# Altium project Function Generator.PrjPcb
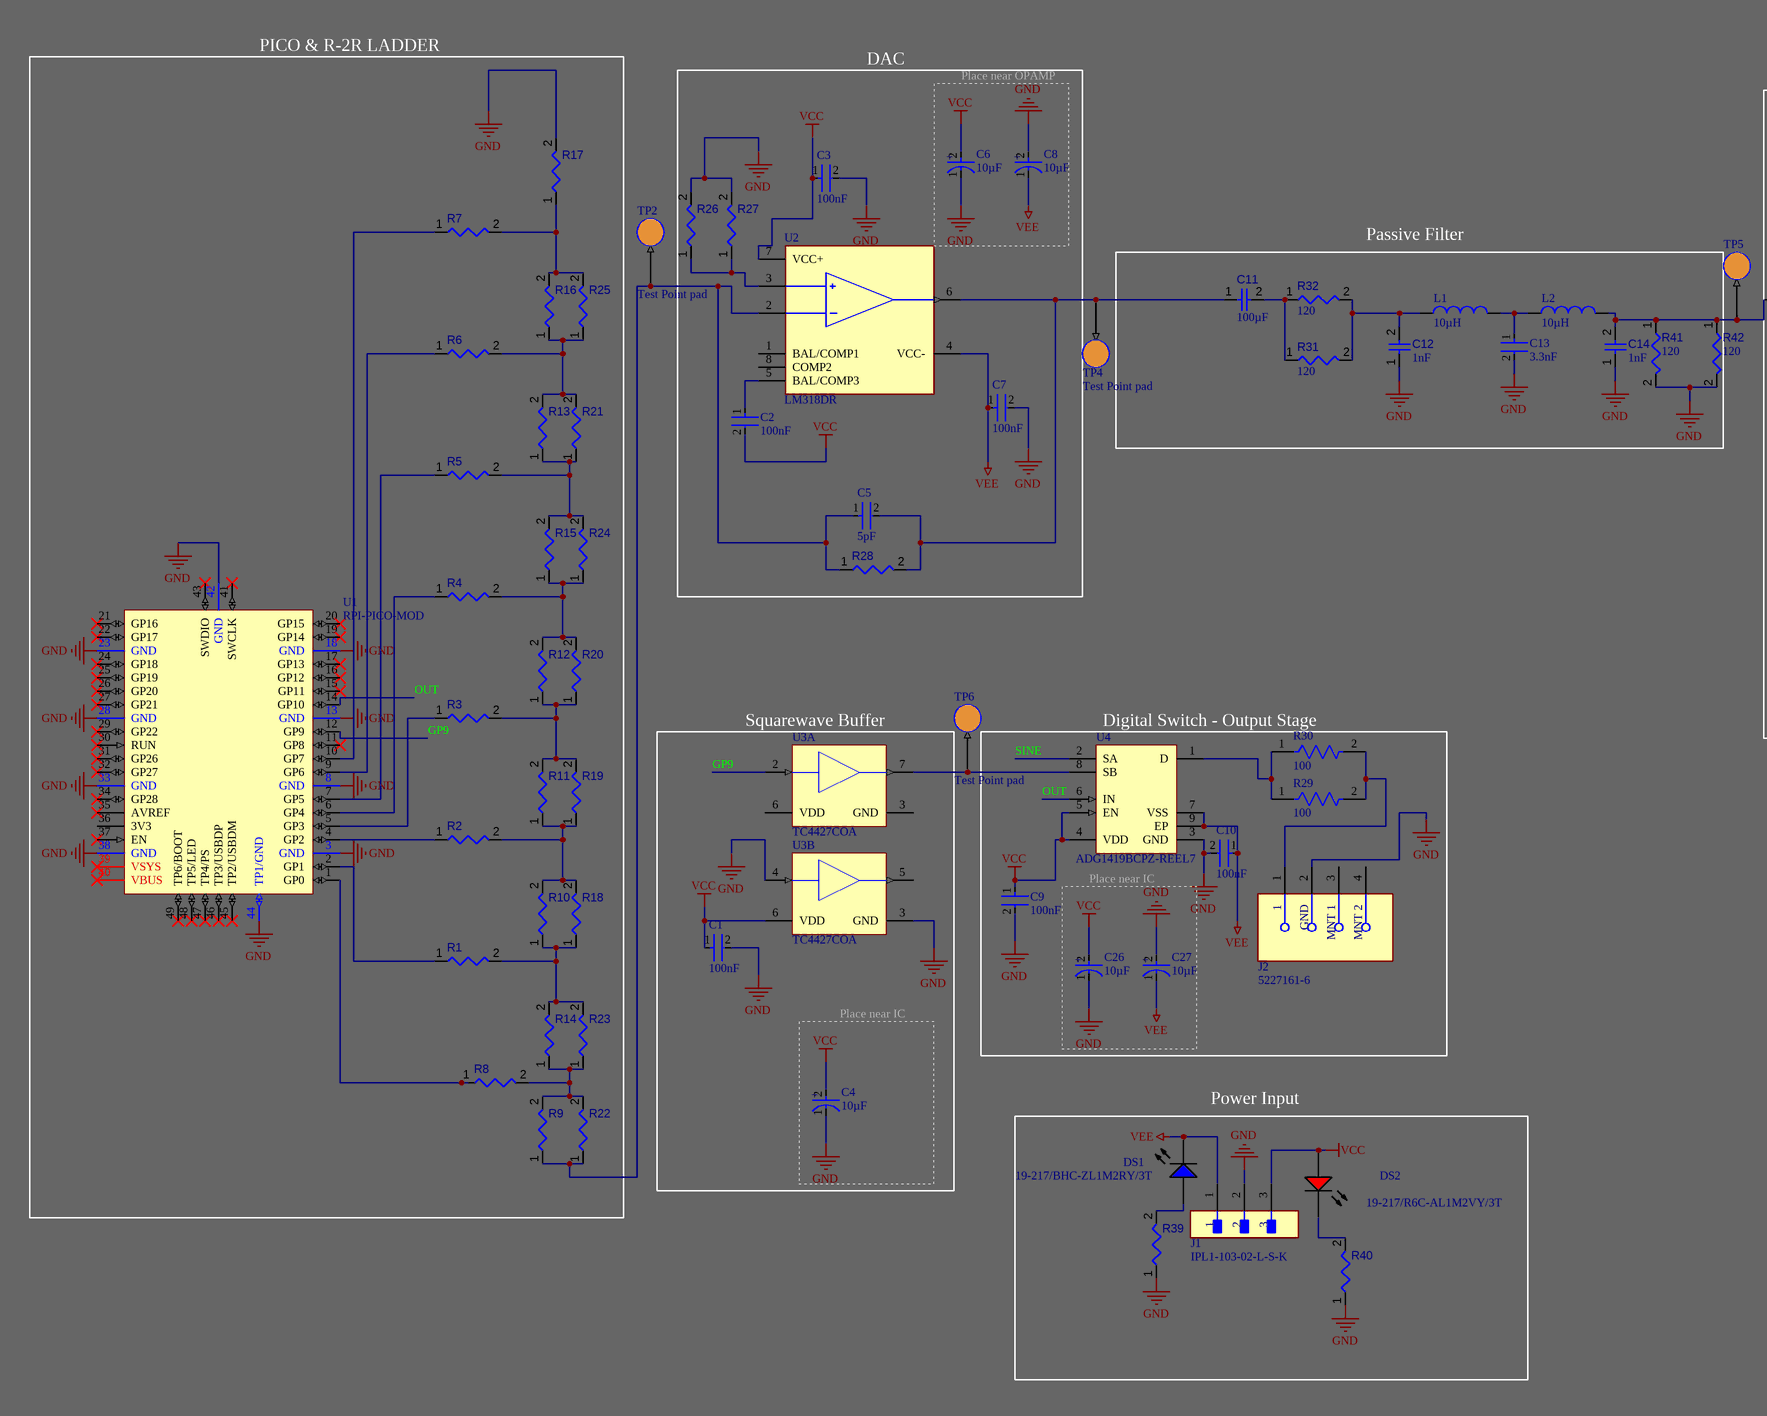
[diagram p0: Function-Generator.SchDoc, left]
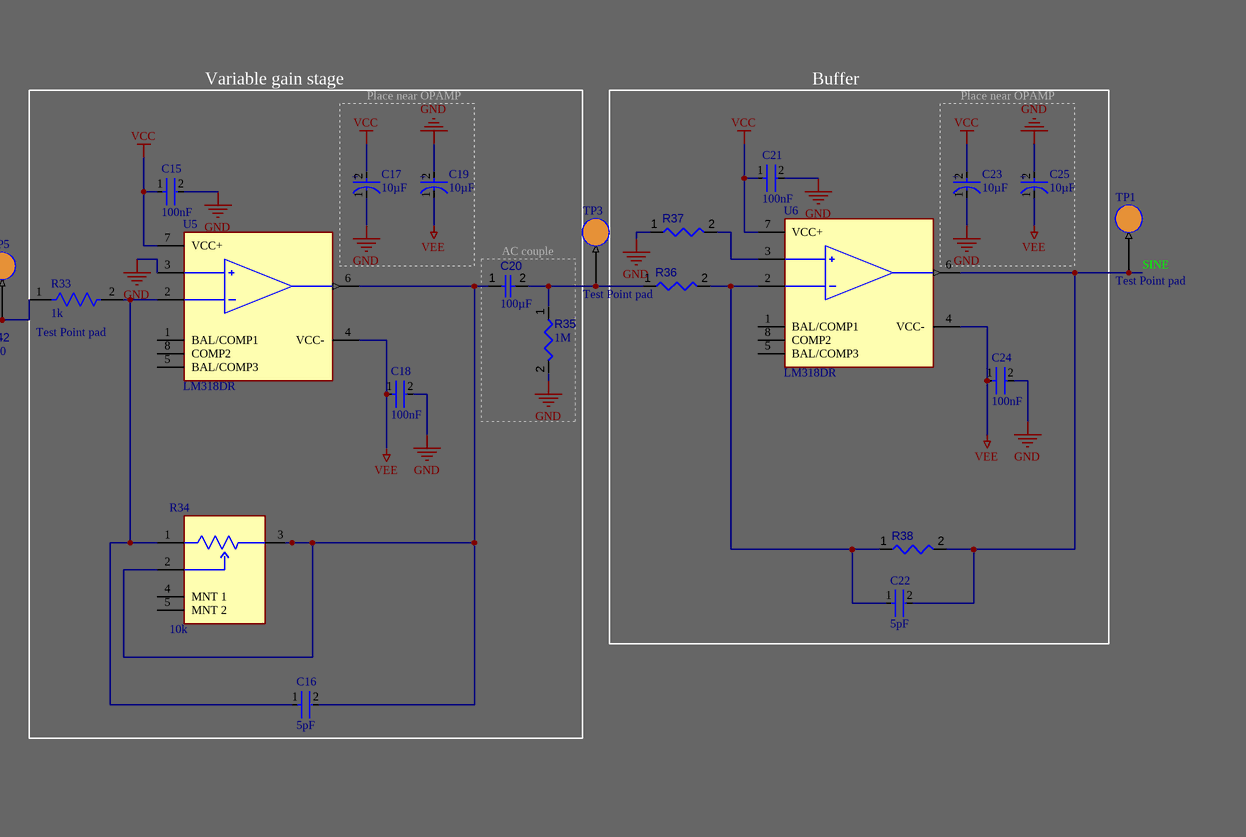
[diagram p1: Function-Generator.SchDoc, right]
1 sheet, 87 parts. Net scope: global (net labels, ports and power ports of the same name join across sheets).
Board file: Function-Generator.PcbDoc

## Sheet Function-Generator.SchDoc: Function Generator
size A2; Author: Lambros Savva; DrawnBy: Lambros Savva; DocumentNumber: 1; Revision: V1.0; SheetNumber: 1; SheetTotal: 1

### Parts
C1  value 100nF  [FP-CC0805-0_85-IPC_A]  (hidden comment: CL21B104KCFNNNE)
C2  value 100nF  [FP-CC0805-0_85-IPC_A]  (hidden comment: CL21B104KCFNNNE)
C3  value 100nF  [FP-CC0805-0_85-IPC_A]  (hidden comment: CL21B104KCFNNNE)
C4  value 10µF  [FP-FTB-MFG]  (hidden comment: EEEFTH100UAR)
C5  value 5pF  [FP-GCH188-0_1-e0_2_0_5-IPC_A]  (hidden comment: GCH1885C2A5R0CE01J)
C6  value 10µF  [FP-FTB-MFG]  (hidden comment: EEEFTH100UAR)
C7  value 100nF  [FP-CC0805-0_85-IPC_A]  (hidden comment: CL21B104KCFNNNE)
C8  value 10µF  [FP-FTB-MFG]  (hidden comment: EEEFTH100UAR)
C9  value 100nF  [FP-CC0805-0_85-IPC_A]  (hidden comment: CL21B104KCFNNNE)
C10  value 100nF  [FP-CC0805-0_85-IPC_A]  (hidden comment: CL21B104KCFNNNE)
C11  value 100µF  [CAPAE660650X800N]  (hidden comment: 25SEV100M6.3X8)
C12  value 1nF  [Chip2PinSM127P600-8N]  (hidden comment: 08055A102FAT2A)
C13  value 3.3nF  [FP-CL10-IPC_B]  (hidden comment: GCM1885C1H332FA16D)
C14  value 1nF  [Chip2PinSM127P600-8N]  (hidden comment: 08055A102FAT2A)
C15  value 100nF  [FP-CC0805-0_85-IPC_A]  (hidden comment: CL21B104KCFNNNE)
C16  value 5pF  [FP-GCH188-0_1-e0_2_0_5-IPC_A]  (hidden comment: GCH1885C2A5R0CE01J)
C17  value 10µF  [FP-FTB-MFG]  (hidden comment: EEEFTH100UAR)
C18  value 100nF  [FP-CC0805-0_85-IPC_A]  (hidden comment: CL21B104KCFNNNE)
C19  value 10µF  [FP-FTB-MFG]  (hidden comment: EEEFTH100UAR)
C20  value 100µF  [CAPAE660650X800N]  (hidden comment: 25SEV100M6.3X8)
C21  value 100nF  [FP-CC0805-0_85-IPC_A]  (hidden comment: CL21B104KCFNNNE)
C22  value 5pF  [FP-GCH188-0_1-e0_2_0_5-IPC_A]  (hidden comment: GCH1885C2A5R0CE01J)
C23  value 10µF  [FP-FTB-MFG]  (hidden comment: EEEFTH100UAR)
C24  value 100nF  [FP-CC0805-0_85-IPC_A]  (hidden comment: CL21B104KCFNNNE)
C25  value 10µF  [FP-FTB-MFG]  (hidden comment: EEEFTH100UAR)
C26  value 10µF  [FP-FTB-MFG]  (hidden comment: EEEFTH100UAR)
C27  value 10µF  [FP-FTB-MFG]  (hidden comment: EEEFTH100UAR)
DS1  19-217/BHC-ZL1M2RY/3T  [EVRL-0603-2_V]
DS2  19-217/R6C-AL1M2VY/3T  [EVRL-0603-2_V]
J1  IPL1-103-02-L-S-K  [FP-IPL1-103-02-L-S-K-0]
J2  5227161-6  [FP-5227161-6-MFG]
L1  value 10µH  [Chip2PinSM127P600-8N]  (hidden comment: SDFL1608S100KTF)
L2  value 10µH  [Chip2PinSM127P600-8N]  (hidden comment: SDFL1608S100KTF)
R1  0805W8F2201T5E  [Chip2PinSM127P600-8N]  (value not drawn)
R2  0805W8F2201T5E  [Chip2PinSM127P600-8N]  (value not drawn)
R3  0805W8F2201T5E  [Chip2PinSM127P600-8N]  (value not drawn)
R4  0805W8F2201T5E  [Chip2PinSM127P600-8N]  (value not drawn)
R5  0805W8F2201T5E  [Chip2PinSM127P600-8N]  (value not drawn)
R6  0805W8F2201T5E  [Chip2PinSM127P600-8N]  (value not drawn)
R7  0805W8F2201T5E  [Chip2PinSM127P600-8N]  (value not drawn)
R8  0805W8F2201T5E  [Chip2PinSM127P600-8N]  (value not drawn)
R9  0805W8F2201T5E  [Chip2PinSM127P600-8N]  (value not drawn)
R10  0805W8F2201T5E  [Chip2PinSM127P600-8N]  (value not drawn)
R11  0805W8F2201T5E  [Chip2PinSM127P600-8N]  (value not drawn)
R12  0805W8F2201T5E  [Chip2PinSM127P600-8N]  (value not drawn)
R13  0805W8F2201T5E  [Chip2PinSM127P600-8N]  (value not drawn)
R14  0805W8F2201T5E  [Chip2PinSM127P600-8N]  (value not drawn)
R15  0805W8F2201T5E  [Chip2PinSM127P600-8N]  (value not drawn)
R16  0805W8F2201T5E  [Chip2PinSM127P600-8N]  (value not drawn)
R17  0805W8F2201T5E  [Chip2PinSM127P600-8N]  (value not drawn)
R18  0805W8F2201T5E  [Chip2PinSM127P600-8N]  (value not drawn)
R19  0805W8F2201T5E  [Chip2PinSM127P600-8N]  (value not drawn)
R20  0805W8F2201T5E  [Chip2PinSM127P600-8N]  (value not drawn)
R21  0805W8F2201T5E  [Chip2PinSM127P600-8N]  (value not drawn)
R22  0805W8F2201T5E  [Chip2PinSM127P600-8N]  (value not drawn)
R23  0805W8F2201T5E  [Chip2PinSM127P600-8N]  (value not drawn)
R24  0805W8F2201T5E  [Chip2PinSM127P600-8N]  (value not drawn)
R25  0805W8F2201T5E  [Chip2PinSM127P600-8N]  (value not drawn)
R26  0805W8F2201T5E  [Chip2PinSM127P600-8N]  (value not drawn)
R27  0805W8F2201T5E  [Chip2PinSM127P600-8N]  (value not drawn)
R28  0805W8F2201T5E  [Chip2PinSM127P600-8N]  (value not drawn)
R29  value 100  [FP-SR0805-MFG]  (hidden comment: SR0805FR-07100RL)
R30  value 100  [FP-SR0805-MFG]  (hidden comment: SR0805FR-07100RL)
R31  value 120  [Chip2PinSM127P600-8N]  (hidden comment: 0805W8F1200T5E)
R32  value 120  [Chip2PinSM127P600-8N]  (hidden comment: 0805W8F1200T5E)
R33  value 1k  [FP-ERA6A-IPC_B]  (hidden comment: ERA6ARB102V)
R34  value 10k  [FP-RK09L1140A2U-MFG]  (hidden comment: RK09L1140A2U)
R35  value 1M  [Chip2PinSM127P600-8N]  (hidden comment: 0805W8F1004T5E)
R36  0805W8F2201T5E  [Chip2PinSM127P600-8N]  (value not drawn)
R37  0805W8F2201T5E  [Chip2PinSM127P600-8N]  (value not drawn)
R38  0805W8F2201T5E  [Chip2PinSM127P600-8N]  (value not drawn)
R39  0805W8F2201T5E  [Chip2PinSM127P600-8N]  (value not drawn)
R40  0805W8F2201T5E  [Chip2PinSM127P600-8N]  (value not drawn)
R41  value 120  [Chip2PinSM127P600-8N]  (hidden comment: 0805W8F1200T5E)
R42  value 120  [Chip2PinSM127P600-8N]  (hidden comment: 0805W8F1200T5E)
TP1  Test Point pad  [TestPointPad-2mm]
TP2  Test Point pad  [TestPointPad-2mm]
TP3  Test Point pad  [TestPointPad-2mm]
TP4  Test Point pad  [TestPointPad-2mm]
TP5  Test Point pad  [TestPointPad-2mm]
TP6  Test Point pad  [TestPointPad-2mm]
U1  RPI-PICO-MOD  [RPI-PICO-MOD]
U2  LM318DR  [FP-D0008A-IPC_B]
U3  TC4427COA  [SOIC-OA8_L]  (parts A,B of 3)
U4  ADG1419BCPZ-REEL7  [ADI-CP-8-4_V]
U5  LM318DR  [FP-D0008A-IPC_B]
U6  LM318DR  [FP-D0008A-IPC_B]

### Blocks framed on the sheet
PICO & R-2R LADDER: R1-R25 U1
DAC: C2 C3 C5 C7 R26-R28 U2
Place near OPAMP: C6 C8
Variable gain stage: C15 C16 C18 R33 R34 U5
Place near OPAMP: C17 C19
Buffer: C21 C22 C24 R36-R38 U6
Place near OPAMP: C23 C25
Passive Filter: C11-C14 L1 L2 R31 R32 R41 R42
AC couple: C20 R35
Squarewave Buffer: C1 U3
Digital Switch - Output Stage: C9 C10 J2 R29 R30 U4
Place near IC: C26 C27
Place near IC: C4
Power Input: DS1 DS2 J1 R39 R40

### Nets
GND: C1.2 C3.2 C4.1(C) C6.1(C) C7.2 C8.2(A) C9.2 C10.2 C12.1 C13.2 C14.1 C15.2 C17.1(C) C18.2 C19.2(A) C21.2 C23.1(C) C24.2 C25.2(A) C26.1(C) C27.2(A) J1.2 J2.2(GND) R17.2 R26.2 R27.2 R35.2 R37.1 R39.1 R40.1 R41.2 R42.2 U1.3(GND) U1.8(GND) U1.13(GND) U1.18(GND) U1.23(GND) U1.28(GND) U1.33(GND) U1.38(GND) U1.42(GND) U1.44(TP1/GND) U3.3(GND) U3.4(INB) U4.3(GND) U5.3(IN+)
VCC: C1.1 C2.2 C3.1 C4.2(A) C6.2(A) C9.1 C15.1 C17.2(A) C21.1 C23.2(A) C26.2(A) DS2.1(A) J1.3 U2.7(VCC+) U3.6(VDD) U4.4(VDD) U4.5(EN) U5.7(VCC+) U6.7(VCC+)
VEE: C7.1 C8.1(C) C10.1 C18.1 C19.1(C) C24.1 C25.1(C) C27.1(C) DS1.2(K) J1.1 U2.4(VCC-) U4.7(VSS) U4.9(EP) U5.4(VCC-) U6.4(VCC-)
GP9: U1.12(GP9) U3.2(INA)
OUT: U1.14(GP10) U4.6(IN)
SINE: C22.2 R38.2 TP1.1 U4.2(SA) U6.6(OUT)
NetC2_1: C2.1 U2.5(BAL/COMP3)
NetC5_1: C5.1 R9.1 R22.1 R28.1 TP2.1 U2.2(IN-)
NetC5_2: C5.2 C11.1 R28.2 TP4.1 U2.6(OUT)
NetC11_2: C11.2 R31.1 R32.1
NetC12_2: C12.2 L1.1 R31.2 R32.2
NetC13_1: C13.1 L1.2 L2.1
NetC14_2: C14.2 L2.2 R33.1 R41.1 R42.1 TP5.1
NetC16_1: C16.1 R33.2 R34.1 U5.2(IN-)
NetC16_2: C16.2 C20.1 R34.2 R34.3 U5.6(OUT)
NetC20_2: C20.2 R35.1 R36.1 TP3.1
NetC22_1: C22.1 R36.2 R38.1 U6.2(IN-)
NetDS1_1: DS1.1(A) R39.2
NetDS2_2: DS2.2(K) R40.2
NetJ2_1: J2.1 R29.2 R30.2
NetR1_1: R1.1 U1.2(GP1)
NetR1_2: R1.2 R10.1 R14.2 R18.1 R23.2
NetR2_1: R2.1 U1.4(GP2)
NetR2_2: R2.2 R10.2 R11.1 R18.2 R19.1
NetR3_1: R3.1 U1.5(GP3)
NetR3_2: R3.2 R11.2 R12.1 R19.2 R20.1
NetR4_1: R4.1 U1.6(GP4)
NetR4_2: R4.2 R12.2 R15.1 R20.2 R24.1
NetR5_1: R5.1 U1.7(GP5)
NetR5_2: R5.2 R13.1 R15.2 R21.1 R24.2
NetR6_1: R6.1 U1.9(GP6)
NetR6_2: R6.2 R13.2 R16.1 R21.2 R25.1
NetR7_1: R7.1 U1.10(GP7)
NetR7_2: R7.2 R16.2 R17.1 R25.2
NetR8_1: R8.1 U1.1(GP0)
NetR8_2: R8.2 R9.2 R14.1 R22.2 R23.1
NetR26_1: R26.1 R27.1 U2.3(IN+)
NetR29_1: R29.1 R30.1 U4.1(D)
NetR37_2: R37.2 U6.3(IN+)
NetTP6_1: TP6.1 U3.7(OUTA) U4.8(SB)

Not connected (* = marked no-connect by the designer): J2 3(MNT_1) 4(MNT_2); R34 4(MNT_1) 5(MNT_2); U1 11(GP8)* 15(GP11)* 16(GP12)* 17(GP13)* 19(GP14)* 20(GP15)* 21(GP16)* 22(GP17)* 24(GP18)* 25(GP19)* 26(GP20)* 27(GP21)* 29(GP22)* 30(RUN)* 31(GP26)* 32(GP27)* 34(GP28)* 35(AVREF)* 36(3V3) 37(EN)* 39(VSYS)* 40(VBUS)* 41(SWCLK)* 43(SWDIO)* 45(TP2/USBDM)* 46(TP3/USBDP)* 47(TP4/PS)* 48(TP5/LED)* 49(TP6/BOOT)*; U2 1(BAL/COMP1) 8(COMP2); U3 5(OUTB); U5 1(BAL/COMP1) 5(BAL/COMP3) 8(COMP2); U6 1(BAL/COMP1) 5(BAL/COMP3) 8(COMP2)

### Notes on the sheet
- (in symbol CMP-001-00086-3) +

### Library data of the parts
C1-C3 C7 C9 C10 C15 C18 C21 C24 = CMP-001-00083-4: 100V 100nF X7R 卤10% 0805 Multilayer Ceramic Capacitors MLCC - SMD/SMT ROHS; Manufacturer Package Identifier: CC0805-0.85; Voltage: 25V; Tolerance: 10%; Halogen Free: Halogen Free; Weight: 5.499807mg; Height: 1.25mm; Termination: SMD/SMT; Dielectric Material: Ceramic; Min Operating Temperature: -55°C; Pins: 2; Composition: Ceramic; Country of Origin: Mainland China, Taiwan; Number of Terminals: 2; RoHS: Compliant; REACH SVHC: Yes; Width: 1.25mm; Material: Ceramic; Length: 2mm; Mounting Technology: Surface Mount; Voltage Rating: 100V; Lead Free: Lead Free; Harmonized Tariff Schedule (HTS) Code: 8532.24.00.20; Introduction Date: 2003-01-27; Export Control Classification Number (ECCN) Code: EAR99; Case Code (Imperial): 0805; Case Code (Metric): 2012; Dielectric: X7R; Depth: 1.25mm; Packaging: Tape and Reel; Voltage Rating (DC): 100V; Case/Package: 0805; Max Operating Temperature: 125°C; Lifecycle Status: Production; China RoHS: Compliant; Radiation Hardening: No; JLCPCB part #: C28233; Thickness: 1.3462mm; Schedule B: 8532240020, 8532240020
C4 C6 C8 C17 C19 C23 C25-C27 = CMP-001-00086-3: Radial Can - SMD ALUMINUM ELECTROLYTIC CAPACITOR FT 50V 10muF ±20% 0.157Dia 4.00mm; Manufacturer Lifecycle Status: ACTIVE; Part Series: FT (High temp. reflow); ESR (Equivalent Series Resistance): 2.3Ω; Ripple Current: 85mA; Dielectric Material: Aluminium; Lead Diameter: 650µm; Dissipation Factor: 10%; Leakage Current: 5µA; Life (Hours): 2000hours; Schedule B: 8532220020, 8532220020; Diameter: 4mm; Voltage Rating (DC): 50V; Lifecycle Status: Production; Harmonized Tariff Schedule (HTS) Code: 8532.22.00.20; Voltage Rating: 50V; RoHS: Compliant; Introduction Date: 2011-10-03; Min Operating Temperature: -55°C; Voltage: 50V; Height: 5.8mm; Number of Terminals: 2; Packaging: Cut Tape; Width: 4.3mm; Lead Free: Lead Free; Radiation Hardening: No; Case/Package: Radial; REACH SVHC: Yes; Length: 5.8mm; Export Control Classification Number (ECCN) Code: EAR99; Ripple Current (AC): 85mA; Pins: 2; Termination: SMD/SMT; Contact Plating: Tin; Ratings: AEC-Q200; Country of Origin: Japan, Malaysia; Lead Pitch: 1mm; Tolerance: 20%; Mounting Technology: Surface Mount; Max Operating Temperature: 105°C; Height - Seated (Max): 6.096mm; JLCPCB part #: C3343
C5 C16 C22 = CMP-001-00085-4: Ceramic Capacitor, YES, Ceramic, 100V, 5% +Tol, 5% -Tol, C0G, 30ppm/Cel TC, 0.000005uF, Surface Mount, 1608M/0603; Manufacturer Lifecycle Status: IN PRODUCTION; Temperature Coefficient: 30ppm/°C; Width: 800µm; Harmonized Tariff Schedule (HTS) Code: 8532.24.00.20; Voltage Rating: 100V; Number of Terminals: 2; Introduction Date: 2015-10-06; Height: 800µm; Lifecycle Status: Production; Dielectric Material: Ceramic; Min Operating Temperature: -55°C; Voltage Rating (DC): 100V; REACH SVHC: Yes; Export Control Classification Number (ECCN) Code: EAR99; Material: Ceramic; Length: 1.6mm; Ratings: AEC-Q200; Thickness: 800µm; Mounting Technology: Surface Mount; Case/Package: 0603; Max Operating Temperature: 125°C; RoHS: Compliant; JLCPCB part #: C1673
C11 C20 = CMP-001-00084-3: Radial Can - SMD ALUMINUM ELECTROLYTIC CAPACITOR SEV 25V 100muF ±20% 0.248Dia 6.30mm; Ripple Current: 145mA; Polarity: Polar; Leakage Current: 25µA; Life (Hours): 2000hours; RoHS: Compliant; Lifecycle Status: Production; Tolerance: 20%; Max Operating Temperature: 85°C; REACH SVHC: Yes; Width: 6.6mm; Number of Terminals: 2; Packaging: Tape & Reel (TR); Case/Package: Radial; Radiation Hardening: No; Height: 8mm; Height - Seated (Max): 8.001mm; Mounting Technology: Surface Mount; Lead Free: Lead Free; Diameter: 6.3mm; Ratings: AEC-Q200; Voltage Rating: 25V; Min Operating Temperature: -40°C; Length: 6.6mm; Voltage Rating (DC): 25V; JLCPCB Part #: C3338
C12 C14 = CMP-001-00088-3: 1nF 50V C0G ±1% 0805 Multilayer Ceramic Capacitors MLCC - SMD/SMT ROHS; Dielectric: CG0; Tolerance: 10%; Country of Origin: Mainland China, Philippines, South Korea; Lead Free: Lead Free; Material: Ceramic; Lifecycle Status: Production; Dielectric Material: Ceramic; Max Operating Temperature: 125°C; Case Code (Metric): 2012; China RoHS: Compliant; Number of Terminals: 2; JLCPCB Part #: C597356; Length: 2mm; Harmonized Tariff Schedule (HTS) Code: 8532.24.00.20; Schedule B: 8532240020, 8532240020; Mounting Technology: Surface Mount; Min Operating Temperature: -55°C; REACH SVHC: Yes; Voltage Rating: 50V; Radiation Hardening: No; Introduction Date: 2010-07-30; Case/Package: 0805; Case Code (Imperial): 0805; Thickness: 939.8µm; Voltage Rating (DC): 50V; Width: 1.25mm; Height: 850µm; Depth: 1.25mm; RoHS: Compliant
C13 = CMP-001-00092-3: 50V 3.3nF C0G ±1% 0603 Multilayer Ceramic Capacitors MLCC - SMD/SMT ROHS; Manufacturer Lifecycle Status: IN PRODUCTION; Dielectric: X7R; Temperature Coefficient: 30ppm/°C; RoHS: Compliant; REACH SVHC: Yes; Depth: 800µm; Tolerance: 1%; Radiation Hardening: No; Case Code (Metric): 1608; Mounting Technology: Surface Mount; Contact Plating: Tin; Height: 800µm; Number of Terminals: 2; Voltage Rating (DC): 50V; Voltage: 50V; Max Operating Temperature: 125°C; Width: 800µm; Case/Package: 0603; Export Control Classification Number (ECCN) Code: EAR99; Schedule B: 8532240020; Lifecycle Status: Production; Ratings: AEC-Q200; Harmonized Tariff Schedule (HTS) Code: 8532.24.00.20; Introduction Date: 2013-11-20; Material: Ceramic; Lead Free: Lead Free; Min Operating Temperature: -55°C; China RoHS: Compliant; Voltage Rating: 50V; Thickness: 800µm; JLCPCB Part #: C3877267; Dielectric Material: Ceramic; Case Code (Imperial): 0603; Length: 1.6mm
DS1 = CMP-007-00003-3: Chip LED, Blue, 5 V, 25 mA, -40 to 85 degC, 2-Pin SMD (0603), RoHS, Tape and Reel; Manufacturer: Everlight Electronics; Luminous Intensity: 28.5mcd; Viewing Angle: 120degrees; Forward Current: 25mA; Lens Style: Diffused; Forward Voltage: 3V; Pins: 2; Max Operating Temperature: 85°C; Manufacturer URL: http://www.everlight.com/; Datasheet URL: https://datasheet.ciiva.com/26901/getdatasheetpartid-420616-26901324.pdf; Package Reference: 0603; RoHS Compliant: True; Packaging: TapeandReel; Package Description: 2-Pin Surface Mount Device, Body 1.6 x 0.8 mm; Mounting Technology: SM; Datasheet Version: Rev. 1.0, 03/2003; Min Operating Temperature: -40°C; Case/Package: 0603; Colour: Blue; JLCPCB Part #: C2288
DS2 = CMP-007-00004-3: Chip LED, Red, 5 V, 25 mA, -40 to 85 degC, 2-Pin SMD (0603), RoHS, Tape and Reel; Manufacturer: Everlight Electronics; Forward Voltage: 2.2V; Lens Style: Clear; Package Reference: 0603; Datasheet Version: Rev. 1, 01/2005; Mounting Technology: SM; RoHS Compliant: False; Datasheet URL: https://datasheet.ciiva.com/4688/el-19-217-r6c-al1m2vy-3tpdf-187026-4688713.pdf; Case/Package: 0603; Colour: Red; Manufacturer URL: http://www.everlight.com/; Package Description: 2-Pin Surface Mount Device, Body 1.6 x 0.8 mm; JLCPCB Part #: C2286
J1 = CMP-002-00080-1: Samtec 2.54mmpitch3pSingle row pin header, IPL1series, right angle, surface; Manufacturer Lifecycle Status: PRODUCTION; Gender: Male; Max Current Rating: 7.4A; Number of Ports: 1; Max Voltage Rating (AC): 675V; Pitch: 2.54mm; Number of Contacts: 3; Packaging: Bulk; JLCPCB Part #: C3326049; Contact Material: Bronze; RoHS: Compliant; Mounting Technology: Surface Mount; Depth: 7.04mm; Termination: Solder; Contact Plating: Gold; Length: 9.14mm; Min Operating Temperature: -55°C; Housing Material: Polymer; Number of Terminals: 3; Lifecycle Status: Production; Number of Rows: 1; Schedule B: 8536694040; Orientation: Straight; Radiation Hardening: No; Max Operating Temperature: 125°C
J2 = CMP-002-00078-1: RF / Coaxial Connector, BNC Coaxial, Right Angle Jack, Solder, 50 ohm, Phosphor Bronze; Manufacturer Lifecycle Status: ACTIVE; Voltage Rating: 500V; Body Material: Zinc; Insulation Resistance: 5GΩ; Sealable: No; Clock Frequency: 4GHz; Number of Positions: 1; Body Plating: Nickel; Tail Length: 4.11mm; Dielectric Material: Polymethylpentene; Operating Force: 15.568N; Gender: Female; Outside Diameter: 14.529mm; Contact Style: Coax; Impedance: 50Ω; Polarity: Normal, Standard; Shielding: Unshielded; Length: 34.93mm; RoHS: Compliant; Max Operating Temperature: 85°C; Orientation: Right Angle; Insulation Color: Black; Mounting Technology: Panel; Contact Material: Gold, Nickel; Min Operating Temperature: -55°C; JLCPCB Part #: C5166169; Shell Finish: Nickel; PCB Mounting Orientation: Right Angle; Housing Material: Polyester; Number of Ports: 1; Contact Plating: Gold; Packaging: Bulk; Depth: 34.93mm; Lead Free: Lead Free; Connector Type: BNC; Export Control Classification Number (ECCN) Code: EAR99; Termination: Solder; Housing Color: Black; Lifecycle Status: Production; Radiation Hardening: No; China RoHS: Non-Compliant; Insulation Material: Polymethylpentene; Harmonized Tariff Schedule (HTS) Code: 8536.69.40.10; Color: Black; Number of Contacts: 1; Fastening Type: Bayonet; Height: 16.13mm; Frequency: 4GHz; Introduction Date: 2008-07-25; REACH SVHC: No
L1 L2 = CMP-006-00021-3: SDFL1608S100KTF, 10uH, 10%, 1 Element, Ferrite-Core, SMD, 0603; DC Resistance (DCR): 1.85Ω; Number of Circuits: 1; Q Factor: 30; Self Resonant Frequency: 17MHz; Test Frequency: 2MHz; Shielding: Shielded; Max Current Rating: 3mA; Export Control Classification Number (ECCN) Code: EAR99; Case/Package: 0603; RoHS: Compliant; Min Operating Temperature: -40°C; Lifecycle Status: Production; Introduction Date: 2012-05-29; Core Material: Ferrite; Tolerance: 10%; Harmonized Tariff Schedule (HTS) Code: 8504.50.80.00; Length: 1.6mm; Width: 800µm; Max Operating Temperature: 85°C; Number of Terminals: 2; REACH SVHC: Yes; Height: 800µm; JLCPCB Part #: C1035
R1-R28 R36-R40 = CMP-009-00182-3: chip resistor 2200Ω ±1% 1/8W 0805; Resistance: 2k2; Case/Package: 0805; JLCPCB Part #: C17520
R29 R30 = CMP-009-00189-3: 125mW Thick Film Resistors 150V ±100ppm/℃ ±1% 100Ω 0805 Chip Resistor - Surface Mount ROHS; Working Voltage: 500V; Temperature Coefficient: 100ppm/°C; Case/Package: 0805; REACH SVHC: Yes; Length: 2mm; Composition: Thick Film; RoHS: Compliant; Max Operating Temperature: 155°C; China RoHS: Non-Compliant; Voltage Rating: 150V; Min Operating Temperature: -55°C; Ratings: AEC-Q200; Number of Terminals: 2; Lifecycle Status: Production; Width: 1.25mm; Tolerance: 1%; Mounting Technology: Surface Mount; Height: 500µm; Power Rating: 125mW; Packaging: Tape & Reel; JLCPCB part #: C17408
R31 R32 R41 R42 = CMP-009-00180-3: Res Thick Film 0805 120 Ohm 1% 0.125W(1/8W) ±100ppm/C Pad SMD T/R; Case/Package: 0805; JLCPCB Part #: C17437
R33 = CMP-009-00186-3: Res Thin Film 0805 1K Ohm 0.1% 0.125W ±10ppm/°C Molded SMD Punched Carrier T/R; Part Series: Thin Film Chip Resistors, High Reliability Type; Manufacturer Lifecycle Status: ACTIVE; JCLPCB part #: C17513; Voltage Rating (DC): 200V; Max Power Dissipation: 125mW; Working Voltage: 100V; Max Operating Temperature: 155°C; Depth: 1.25mm; Military Standard: Not; Termination: SMD/SMT; Introduction Date: 2012-05-24; Lead Free: Lead Free; Tolerance: 0.1%; Number of Terminals: 2; RoHS: Compliant; Export Control Classification Number (ECCN) Code: EAR99; Composition: Thin Film; Harmonized Tariff Schedule (HTS) Code: 8533.21.00.30; Mounting Technology: Surface Mount; Schedule B: 8533210045; Number of Terminations: 2; Case Code (Imperial): 0805; Height: 500µm; Power Rating: 125mW; Country of Origin: Japan; Case Code (Metric): 2012; Min Operating Temperature: -55°C; Radiation Hardening: No; Width: 1.25mm; REACH SVHC: Yes; Lifecycle Status: Production; Length: 2mm; Contact Plating: Tin; Voltage Rating: 100V; Temperature Coefficient: 10ppm/°C; Packaging: Cut Tape; Ratings: AEC-Q200; Pins: 2; Case/Package: 0805; JLCPCB Part #: C17513
R34 = CMP-009-00188-3: 10k Ohm 1 Gang Linear Through Hole Potentiometer 1.0 Turns 0.05W, 1/20W PC Pins; Tolerance: 20%; Number of Turns: 1; Working Voltage: 10V; Hole Diameter: 9mm; Power Rating: 50mW; Voltage Rating: 50V; Lead Length: 3.5mm; Depth: 7.45mm; Width: 10.7mm; RoHS: Compliant; Number of Terminals: 3; Height: 7.45mm; Manufacturer Package Identifier: RK09L1140A2U; Type: Potentiometer; Introduction Date: 2010-01-19; Taper: Linear; Max Operating Temperature: 70°C; Mounting Technology: Brackets, Panel, Through Hole; Length: 11.35mm; Termination: Pin; Export Control Classification Number (ECCN) Code: EAR99; Lifecycle Status: Production; Radiation Hardening: No; Composition: Potentiometer; Min Operating Temperature: -10°C; JLCPCB part #: C470448
R35 = CMP-009-00177-2: Res Thick Film 0805 1M Ohm 1% 0.125W(1/8W) ±100ppm/C Pad SMD T/R; Case/Package: 0805; JLCPCB Part #: C17514
TP1-TP6 = CMP-002-00079-1
U1 = CMP-003-000001-2: RASPBERRY PI PICO RP2040 BOARD; Manufacturer: Raspberry Pi Foundation; Manufacturer Part No: SC0915; Mounting Technology: SMT; Source: RPi_Pico.SchLib; Design Item ID: RPI-PICO-MOD; Supplier Link: https://www.digikey.com/en/products/detail/raspberry-pi/SC0915/13684020; Supplier Part No: 2648-SC0915CT-ND
U2 U5 U6 = CMP-014-00003-3: Single, 40-V, 15-MHz operational amplifier 8-SOIC 0 to 70; Manufacturer Lifecycle Status: ACTIVE; JCLPCB part #: C2871089; Output Current per Channel: 20mA; Operating Supply Current: 5mA; Operating Supply Voltage: 20V; Input Offset Voltage (Vos): 4mV; Number of Elements: 1; Gain Bandwidth Product: 15MHz; Common Mode Rejection Ratio: 70dB; Min Supply Voltage: 10V; Max Junction Temperature (Tj): 150°C; Slew Rate: 70V/µs; Dual Supply Voltage: 9V; Max Supply Voltage: 40V; Input Bias Current: 150nA; Min Dual Supply Voltage: 5V; Voltage Gain: 106.02dB; Lead Free: Lead Free; Packaging: Cut Tape (CT); Schedule B: 8542330000, 8542330000; Mounting Technology: Surface Mount; Length: 4.9mm; Case/Package: SOIC; Max Operating Temperature: 70°C; Ambient Temperature Range High: 70°C; Height: 1.75mm; Number of Channels: 1; Thickness: 1.58mm; Min Operating Temperature: 0°C; Pins: 8; Bandwidth: 15MHz; Width: 3.91mm; Lifecycle Status: Production; RoHS: Compliant; Nominal Supply Current: 5mA; Radiation Hardening: No; Number of Circuits: 1; -3db Bandwidth: 15MHz; Max Dual Supply Voltage: 20V; JLCPCB Part #: C1347395
U3 = CMP-014-00004-2: TC4427COA; Dual MOSFET Power Driver 1.5A; 4.5 to 18V; Non-Inverting; 8-Pin SOIC; Manufacturer Lifecycle Status: REL; Min Supply Voltage: 4.5V; Turn-On Delay Time: 30ns; Propagation Delay: 50ns; Max Output Voltage: 25mV; Number of Channels: 2; Input Bias Current: 10µA; Power Dissipation: 470mW; Nominal Supply Current: 4.5mA; Value: 12Ω; HS Code: 8542.39.0090; Height: 1.42mm; Lifecycle Status: Production; Fall Time: 30ns; Length: 4.9mm; RoHS: Compliant; Country of Origin: Thailand; Radiation Hardening: No; Harmonized Tariff Schedule (HTS) Code: 8542.39.0060; Export Control Classification Number (ECCN) Code: EAR99; Mounting Technology: Surface Mount, Through Hole; Projected EOL Date: 2034-05-16; Number of Drivers: 2; Max Output current: 1.5A; Output Voltage: 18V; Pins: 8; Lead Free: Lead Free; Packaging: Bulk; Output Current: 1.5A; Width: 3.91mm; Introduction Date: 2002-05-16; Min Operating Temperature: 0°C; Country of Fabrication: United States of America; REACH SVHC: No; Case/Package: SOIC; Schedule B: 8542390000, 8542390000; Number of Outputs: 2; Rise Time: 30ns; Turn-Off Delay Time: 30ns; Max Operating Temperature: 150°C; Country of Assembly: Thailand; Max Supply Current: 4.5mA; Max Power Dissipation: 470mW; Max Supply Voltage: 18V; JLCPCB Part #: C636890
U4 = CMP-011-00014-2: Other Interface ICs; ADG1419BCPZ-REEL7; ANALOG DEVICES; 8; 16.5 V; 5 V; LFCSP EP; Manufacturer Lifecycle Status: PRODUCTION; Dual Supply Voltage: 15V; Max Supply Voltage: 16.5V; Min Dual Supply Voltage: 4.5V; Value: 2.4Ω; Insertion Loss (dB): 0.16dB; Max Supply Current: 190µA; Max Power Dissipation: 2mW; Supply Type: Dual, Single; Polarity: Non-Inverting; Interface: Parallel; -3db Bandwidth: 135MHz; Number of Outputs: 2; Min Supply Voltage: 5V; Turn-On Delay Time: 110ns; Operating Supply Voltage: 12V; Number of Circuits: 1; Test Frequency: 1MHz; Turn-Off Delay Time: 140ns; Packaging: Cut Tape; REACH SVHC: No; Lifecycle Status: Production; RoHS: Compliant; Schedule B: 8542390000, 8542390000; Min Operating Temperature: -40°C; Drain to Source Resistance: 2.4Ω; Case/Package: LFCSP EP; Bandwidth: 135MHz; Power Dissipation: 2mW; Pins: 8; Max Operating Temperature: 125°C; Number of Inputs: 1; Max Dual Supply Voltage: 16.5V; Radiation Hardening: No; Number of Channels: 1; Lead Free: Contains Lead; Contact Plating: Tin; JLCPCB Part #: C206632